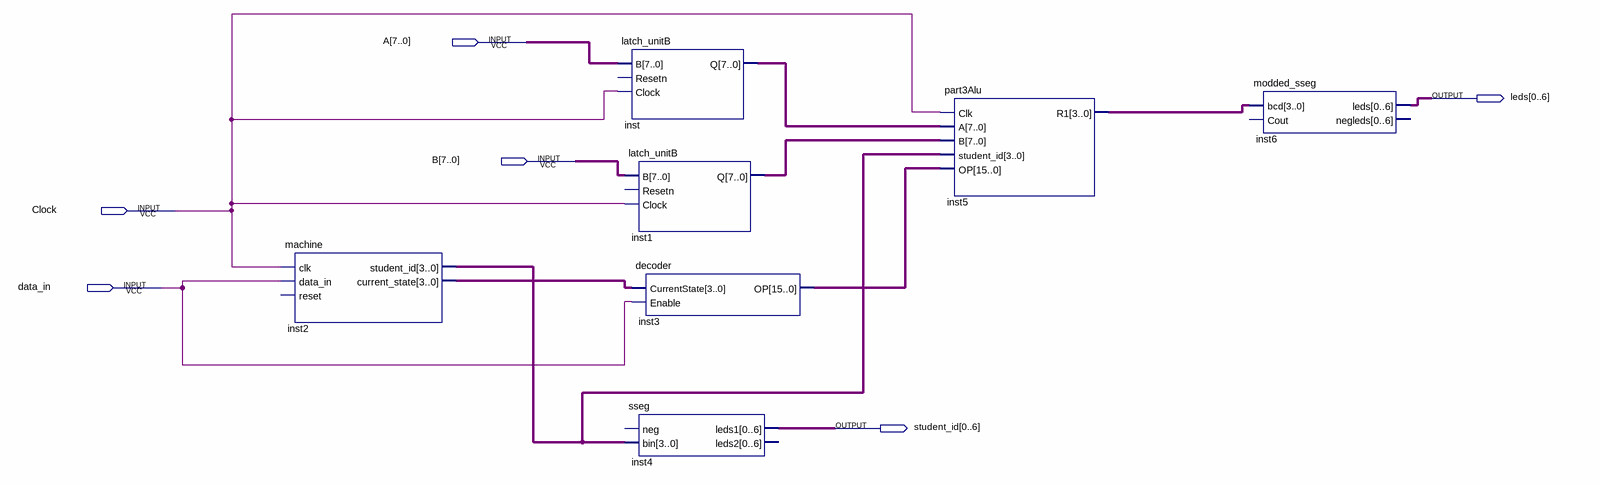
[diagram p0: schematic sheet]
// Quartus schematic Block3.bdf as structural Verilog: 7 symbols, 6 pins
module Block3 (
  input  [7:0] A,
  input  [7:0] B,
  input  Clock,
  input  data_in,
  output [0:6] leds,
  output [0:6] student_id
);

  wire [3:0] inst2_current_state, inst2_student_id, inst5_r1;
  wire [7:0] inst1_q, inst_q;
  wire [15:0] inst3_op;

  machine inst2 (
    .clk(Clock), .data_in(data_in), .student_id(inst2_student_id), .current_state(inst2_current_state));  // open: reset
  latch_unitB inst (.B(A), .Clock(Clock), .Q(inst_q));  // open: Resetn
  latch_unitB inst1 (.B(B), .Clock(Clock), .Q(inst1_q));  // open: Resetn
  sseg inst4 (.bin(inst2_student_id), .leds1(student_id));  // open: neg, leds2
  decoder inst3 (.CurrentState(inst2_current_state), .Enable(data_in), .OP(inst3_op));
  part3Alu inst5 (.Clk(Clock), .A(inst_q), .B(inst1_q), .student_id(inst2_student_id), .OP(inst3_op), .R1(inst5_r1));
  modded_sseg inst6 (.bcd(inst5_r1), .leds(leds));  // open: Cout, negleds
endmodule
